# Altium schematic sheet SD&USB.SchDoc: SD&USB
size A4
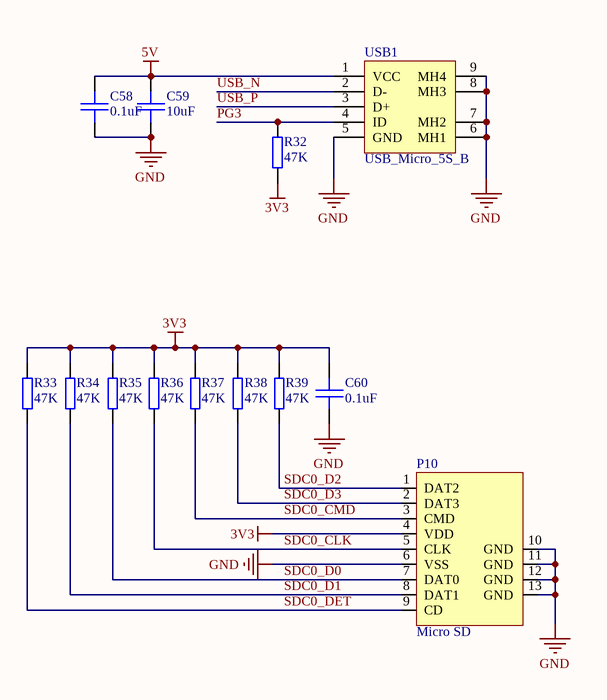
[diagram p0: SD&USB.SchDoc]

## Parts
C58  0.1uF  [CAP-0603]
C59  10uF  [CAP-1206]
C60  0.1uF  [CAP-0603]
P10  Micro SD  [7MSDP-B0-1012]
R32  47K  [RES-0603]
R33  47K  [RES-0603]
R34  47K  [RES-0603]
R35  47K  [RES-0603]
R36  47K  [RES-0603]
R37  47K  [RES-0603]
R38  47K  [RES-0603]
R39  47K  [RES-0603]
USB1  USB_Micro_5S_B  [USB_MICRO_5S_B]

## Nets
3V3: C60.1 P10.4(VDD) R32.2 R33.2 R34.2 R35.2 R36.2 R37.2 R38.2 R39.2
5V: C58.1 C59.1 USB1.1(VCC)
GND: C58.2 C59.2 C60.2 P10.6(VSS) P10.10(GND) P10.11(GND) P10.12(GND) P10.13(GND) USB1.5(GND) USB1.6(MH1) USB1.7(MH2) USB1.8(MH3) USB1.9(MH4)
PG3: R32.1 USB1.4(ID)
SDC0_CLK: P10.5(CLK) R36.1
SDC0_CMD: P10.3(CMD) R37.1
SDC0_D0: P10.7(DAT0) R35.1
SDC0_D1: P10.8(DAT1) R34.1
SDC0_D2: P10.1(DAT2) R39.1
SDC0_D3: P10.2(DAT3) R38.1
SDC0_DET: P10.9(CD) R33.1
USB_N: USB1.2(D-)
USB_P: USB1.3(D+)

## Notes on the sheet
- Title
- Size:
- Date:
- A4
- Number:
- Time:
- Revision:
- Sheet
- of
- File:

## Library data of the parts
C58 C60 = C_0603: 陶瓷贴片电容0603; tolerance: 10%; voltage: 50V; ESR: 1.73mOhm; IRMS: 5.59A; C_value: 0.1uF; Series: X7R
C59 = C_1206: 陶瓷贴片电容1206; tolerance: 10%; voltage: 50V; C_value: 10uF
P10 = Micro SD: Micro SD卡座
R32-R39 = R_0603: 贴片电阻0603; tolerance: 5%; voltage: 50V; power: 0.063W; R_value: 47K
USB1 = USB_Micro_5S_B: micro USB母座5SB型